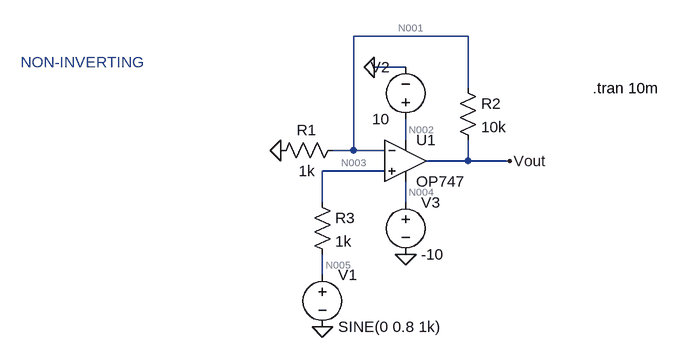
[diagram p0: schematic noninv_.asc]
noninv_.asc, the LTspice schematic file:
Version 4.1
SHEET 1 880 680
WIRE 176 80 0 80
WIRE 80 128 32 128
WIRE 176 160 176 80
WIRE 80 240 80 208
WIRE 0 256 0 80
WIRE 0 256 -32 256
WIRE 48 256 0 256
WIRE 176 272 176 240
WIRE 176 272 112 272
WIRE 240 272 176 272
WIRE 48 288 -48 288
WIRE -48 336 -48 288
WIRE 80 336 80 304
WIRE -48 448 -48 416
FLAG 32 128 0
FLAG 80 416 0
FLAG -112 256 0
FLAG 240 272 Vout
FLAG -48 528 0
SYMBOL OpAmps\\OP747 80 208 R0
SYMATTR InstName U1
SYMBOL res -16 240 R90
WINDOW 0 0 56 VBottom 2
WINDOW 3 32 56 VTop 2
SYMATTR InstName R1
SYMATTR Value 1k
SYMBOL res 160 144 R0
SYMATTR InstName R2
SYMATTR Value 10k
SYMBOL res -64 320 R0
SYMATTR InstName R3
SYMATTR Value 1k
SYMBOL voltage -48 432 R0
WINDOW 123 0 0 Left 0
WINDOW 39 0 0 Left 0
SYMATTR InstName V1
SYMATTR Value SINE(0 0.8 1k)
SYMBOL voltage 80 224 R180
WINDOW 0 24 96 Left 2
WINDOW 3 24 16 Left 2
WINDOW 123 0 0 Left 0
WINDOW 39 0 0 Left 0
SYMATTR InstName V2
SYMATTR Value 10
SYMBOL voltage 80 320 R0
WINDOW 123 0 0 Left 0
WINDOW 39 0 0 Left 0
SYMATTR InstName V3
SYMATTR Value -10
TEXT -512 120 Left 2 ;NON-INVERTING
TEXT 368 160 Left 2 !.tran 10m

The netlist it stands for:
* noninv_.asc
X§U1 N003 N001 N002 N004 Vout OP747  ; pins In+ In- V+ V- OUT
R1 N001 0 1k
R2 N001 Vout 10k
R3 N003 N005 1k
V1 N005 0 SINE(0 0.8 1k)
V2 N002 0 10
V3 N004 0 -10
* NON-INVERTING
.tran 10m
.backanno
.end

* Results of the author's LTspice run, read from the files saved beside the schematic
* Operating Point, zero values left out:
*   V(n001) = 91.21 µV
*   V(n004) = -10 V
*   V(vout) = 911.2 µV
*   V(n003) = 11.21 µV
*   V(n002) = 10 V
*   I(R3) = 11.21 nA
*   I(R1) = 91.21 nA
*   I(V3) = 268.5 µA
*   I(R2) = -82 nA
*   I(V1) = 11.21 nA
*   I(V2) = -268.6 µA
*   Ix(u1:1) = -11.21 nA
*   Ix(u1:2) = -9.214 nA
*   Ix(u1:99) = 268.6 µA
*   Ix(u1:50) = -268.5 µA
*   Ix(u1:45) = -82 nA
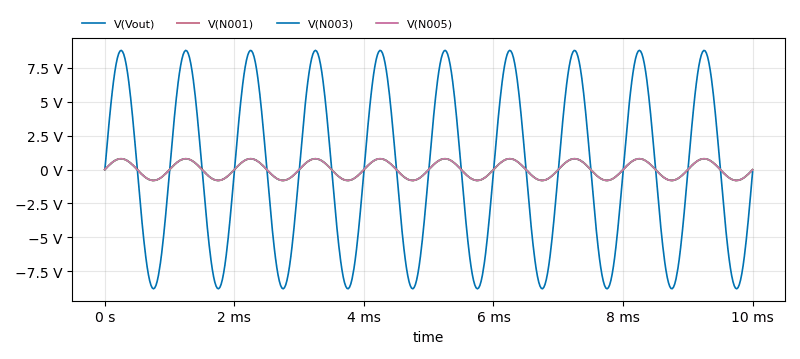
[diagram p1: Transient Analysis of noninv_.asc, plotted from the saved traces]
* Transient Analysis, 1 run:
*   V(Vout): min -8.798 V, max 8.8 V, average 359.6 µV, rms 6.218 V, last -144.2 mV
*   V(N001): min -799.8 mV, max 800 mV, average 41.07 µV, rms 565.3 mV, last -13.1 mV
*   V(N003): min -799.9 mV, max 800 mV, average -42.08 µV, rms 565.4 mV, last 8.663 µV
*   V(N005): min -799.9 mV, max 800 mV, average -53.3 µV, rms 565.4 mV, last 0 V